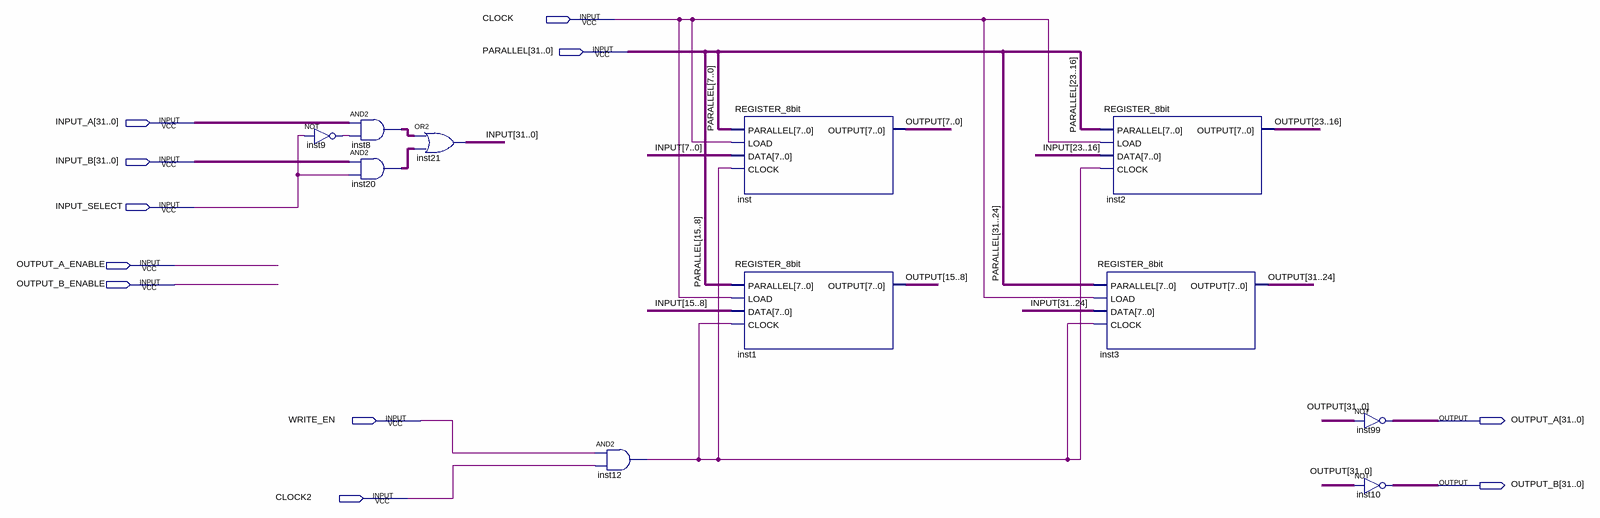
[diagram p0: schematic sheet]
// Quartus schematic REGISTER_32BIT.bdf as structural Verilog: 11 symbols, 11 pins
module REGISTER_32BIT (
  input  CLOCK,
  input  [31:0] PARALLEL,
  input  [31:0] INPUT_A,
  input  [31:0] INPUT_B,
  input  INPUT_SELECT,
  input  OUTPUT_A_ENABLE,
  input  OUTPUT_B_ENABLE,
  input  WRITE_EN,
  input  CLOCK2,
  output [31:0] OUTPUT_A,
  output [31:0] OUTPUT_B
);

  wire inst9_out, inst12_out;
  wire [31:0] INPUT, inst8_out, inst20_out, OUTPUT;

  not inst9 (inst9_out, INPUT_SELECT);
  assign inst8_out = INPUT_A & {32{inst9_out}};  // AND2 inst8, 32 bits wide
  assign inst20_out = INPUT_B & {32{INPUT_SELECT}};  // AND2 inst20, 32 bits wide
  assign INPUT = inst8_out | inst20_out;  // OR2 inst21, 32 bits wide
  and inst12 (inst12_out, WRITE_EN, CLOCK2);
  REGISTER_8bit inst (
    .PARALLEL(PARALLEL[7:0]), .LOAD(CLOCK), .DATA(INPUT[7:0]), .CLOCK(inst12_out), .OUTPUT(OUTPUT[7:0]));
  REGISTER_8bit inst1 (
    .PARALLEL(PARALLEL[15:8]), .LOAD(CLOCK), .DATA(INPUT[15:8]), .CLOCK(inst12_out), .OUTPUT(OUTPUT[15:8]));
  REGISTER_8bit inst2 (
    .PARALLEL(PARALLEL[23:16]), .LOAD(CLOCK), .DATA(INPUT[23:16]), .CLOCK(inst12_out), .OUTPUT(OUTPUT[23:16]));
  REGISTER_8bit inst3 (
    .PARALLEL(PARALLEL[31:24]), .LOAD(CLOCK), .DATA(INPUT[31:24]), .CLOCK(inst12_out), .OUTPUT(OUTPUT[31:24]));
  assign OUTPUT_A = ~OUTPUT;  // NOT inst99, 32 bits wide
  assign OUTPUT_B = ~OUTPUT;  // NOT inst10, 32 bits wide
endmodule
